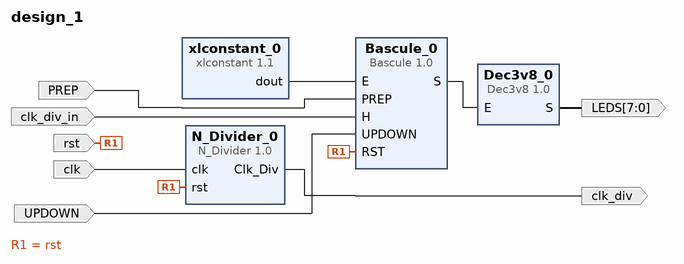
[diagram p0: block diagram of the top level]
# Vivado block design design_1, xc7z020clg484-1, Vivado 2018.2
create_bd_design design_1

create_bd_port -dir I -type rst rst
create_bd_port -dir I -type clk clk
set_property -dict {CONFIG.FREQ_HZ 100000000} [get_bd_ports clk]
create_bd_port -dir O -from 7 -to 0 LEDS
create_bd_port -dir I PREP
create_bd_port -dir O clk_div
create_bd_port -dir I clk_div_in
create_bd_port -dir I UPDOWN

create_bd_cell -type ip -vlnv xilinx.com:user:Dec3v8:1.0 Dec3v8_0
create_bd_cell -type ip -vlnv xilinx.com:ip:xlconstant:1.1 xlconstant_0
set_property -dict {CONFIG.CONST_WIDTH 4 CONFIG.CONST_VAL 5} [get_bd_cells xlconstant_0]
create_bd_cell -type ip -vlnv xilinx.com:user:N_Divider:1.0 N_Divider_0
set_property -dict {CONFIG.N 90000000} [get_bd_cells N_Divider_0]
create_bd_cell -type ip -vlnv xilinx.com:user:Bascule:1.0 Bascule_0

# ---- connections ----

connect_bd_net [get_bd_ports rst] [get_bd_pins N_Divider_0/rst] [get_bd_pins Bascule_0/RST]
connect_bd_net [get_bd_ports clk] [get_bd_pins N_Divider_0/clk]
connect_bd_net [get_bd_pins xlconstant_0/dout] [get_bd_pins Bascule_0/E]
connect_bd_net [get_bd_pins Bascule_0/S] [get_bd_pins Dec3v8_0/E]
connect_bd_net [get_bd_pins Dec3v8_0/S] [get_bd_ports LEDS]
connect_bd_net [get_bd_ports PREP] [get_bd_pins Bascule_0/PREP]
connect_bd_net [get_bd_pins N_Divider_0/Clk_Div] [get_bd_ports clk_div]
connect_bd_net [get_bd_ports clk_div_in] [get_bd_pins Bascule_0/H]
connect_bd_net [get_bd_ports UPDOWN] [get_bd_pins Bascule_0/UPDOWN]

validate_bd_design
save_bd_design
